# Altium project EPS-LKAS Manipulator.PrjPcb
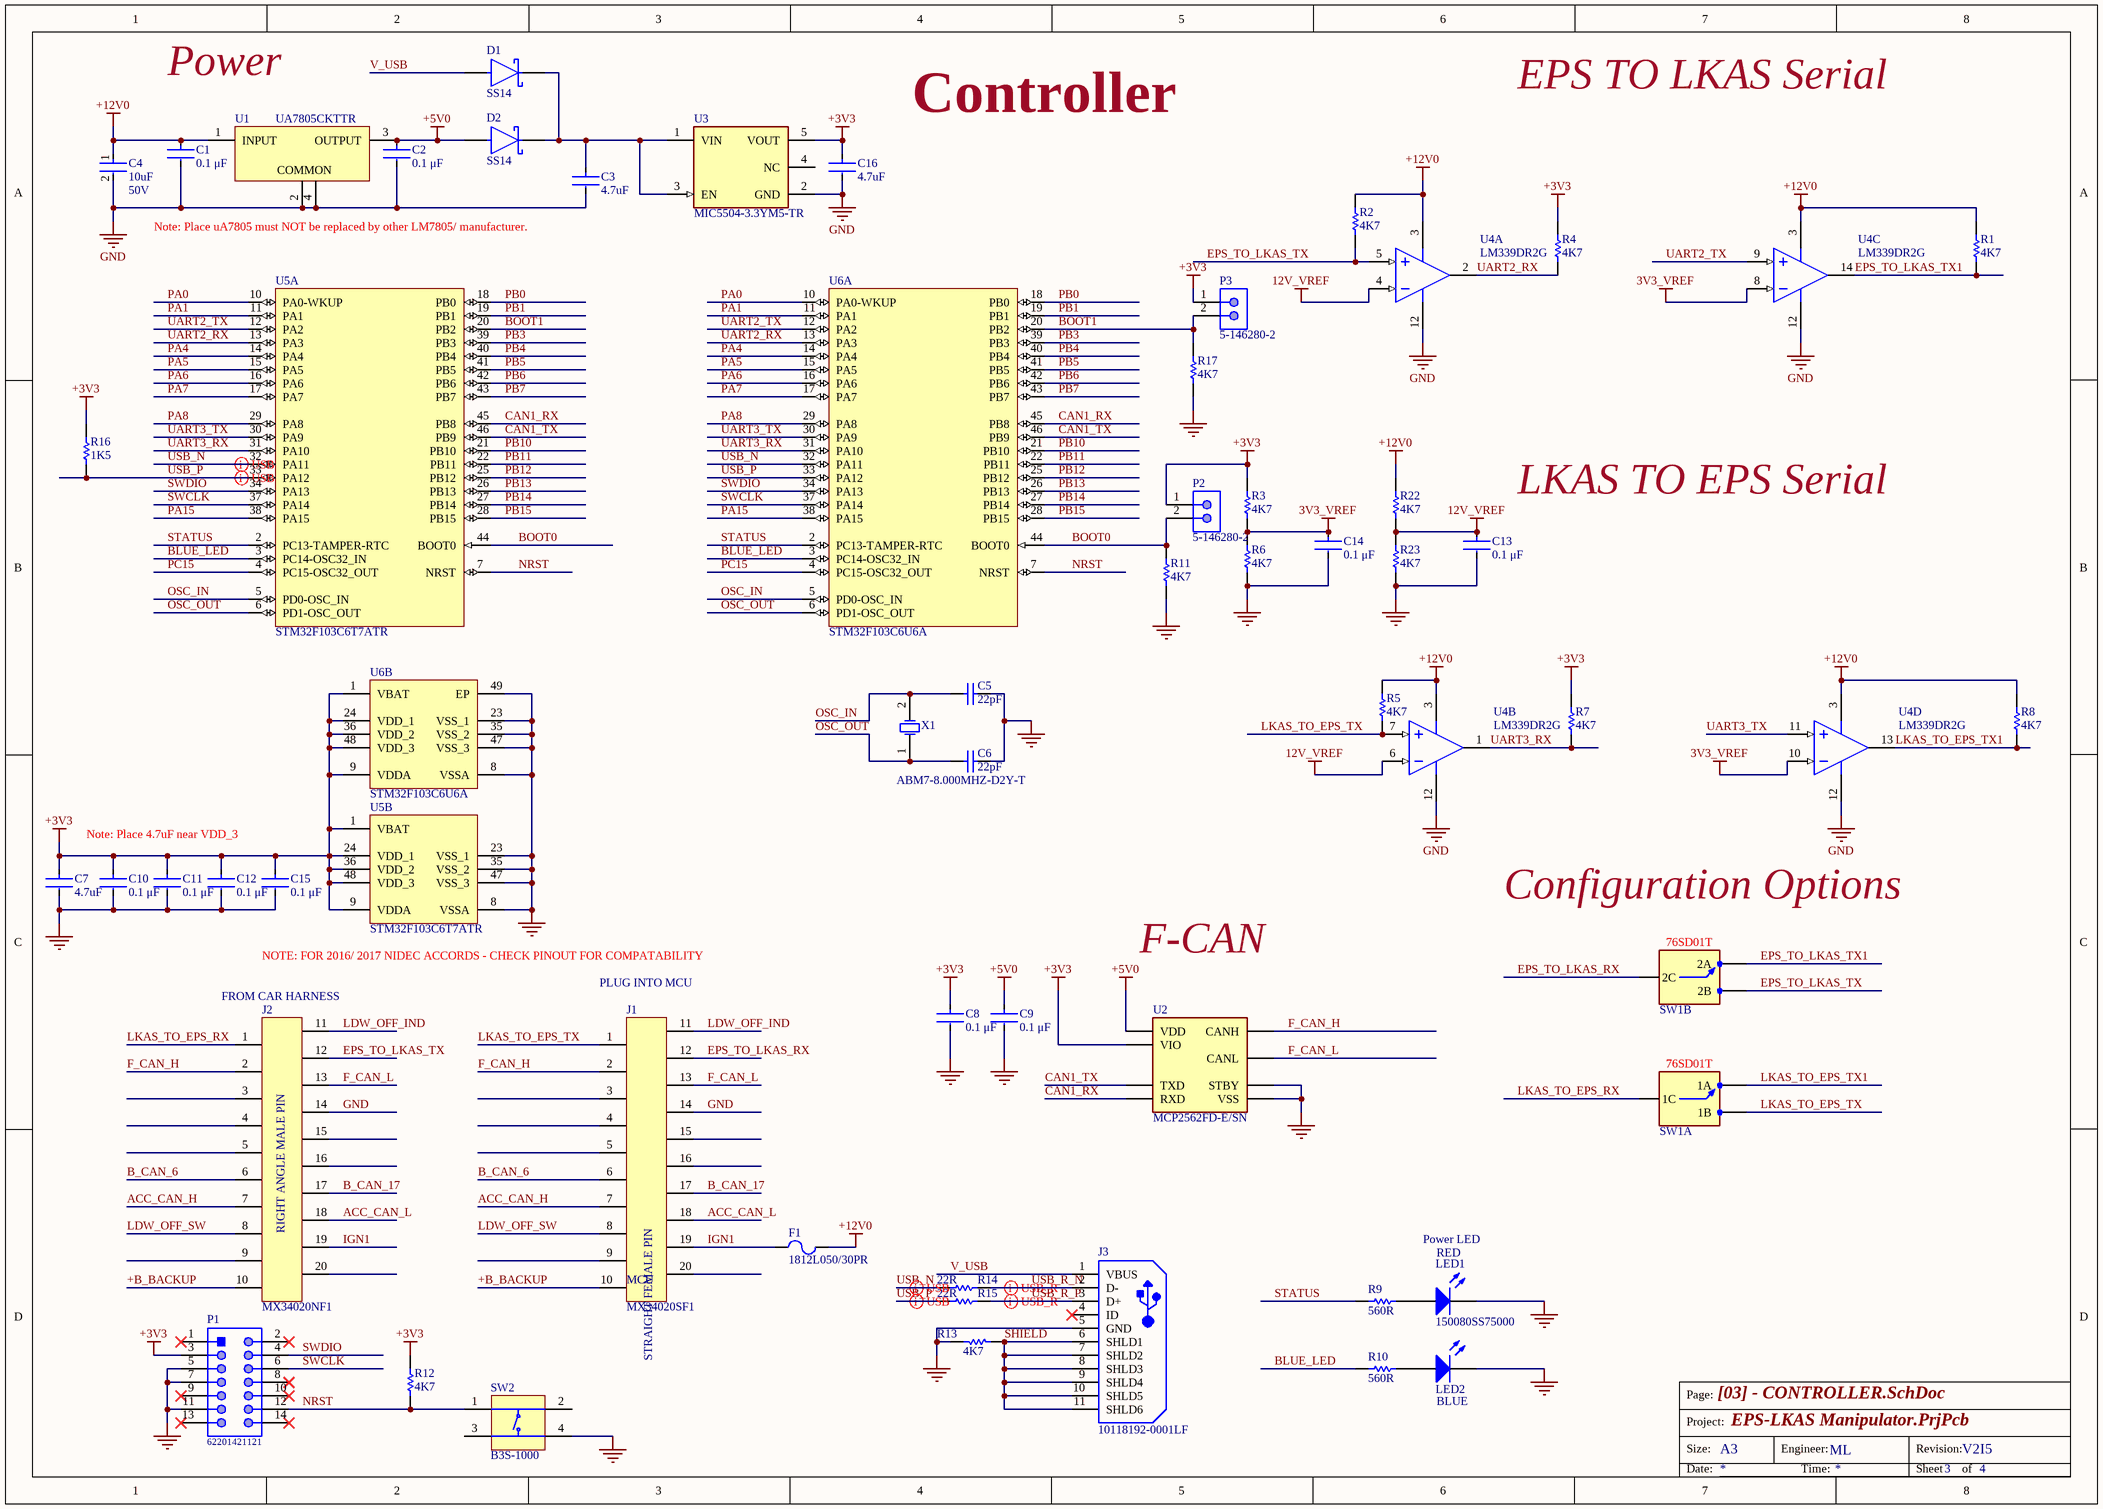
[diagram p0: [03] - CONTROLLER.SchDoc]
VersionRevision: V2I5; Project: EPS/LKAS Manipulator; Company: DEVINSTRUMENTS
2 sheets, 55 parts. Net scope: global (net labels, ports and power ports of the same name join across sheets).
Board files: LKAS-EPS_PCB_V2I5.PcbDoc, DO NOT USE LKAS-EPS_PCB_V2I1.PcbDoc
Sheets:
  [03] - CONTROLLER.SchDoc
  [04] - DOC REVISION HISTORY.SchDoc

## Sheet [03] - CONTROLLER.SchDoc
size A3; DocumentNumber: 3; SheetNumber: 3; SheetTotal: 4; Organization: Altium Limited; Address1: L3, 12a Rodborough Rd; Address2: Frenchs Forest; Address3: NSW; Address4: Australia 2086

### Parts
C1  Capacitance: 0.1 μF  [FP-C0603C-CF-MFG]  (hidden comment: C0603C104M3RACTU)
C2  Capacitance: 0.1 μF  [FP-C0603C-CF-MFG]  (hidden comment: C0603C104M3RACTU)
C3  Capacitance: 4.7uF  [FP-CL10-IPC_C]  (hidden comment: CL10B475KQ8NQNC)
C4  value 10uF  Voltage: 50V  [FP-CL31-IPC_C]  (hidden comment: CL31A106KBHNNNE)
C5  Capacitance: 22pF  [CAPC1608X90X35ML10T15]  (hidden comment: GRM1885C1H220JA01D)
C6  Capacitance: 22pF  [CAPC1608X90X35ML10T15]  (hidden comment: GRM1885C1H220JA01D)
C7  Capacitance: 4.7uF  [FP-CL10-IPC_C]  (hidden comment: CL10B475KQ8NQNC)
C8  Capacitance: 0.1 μF  [FP-C0603C-CF-MFG]  (hidden comment: C0603C104M3RACTU)
C9  Capacitance: 0.1 μF  [FP-C0603C-CF-MFG]  (hidden comment: C0603C104M3RACTU)
C10  Capacitance: 0.1 μF  [FP-C0603C-CF-MFG]  (hidden comment: C0603C104M3RACTU)
C11  Capacitance: 0.1 μF  [FP-C0603C-CF-MFG]  (hidden comment: C0603C104M3RACTU)
C12  Capacitance: 0.1 μF  [FP-C0603C-CF-MFG]  (hidden comment: C0603C104M3RACTU)
C13  Capacitance: 0.1 μF  [FP-C0603C-CF-MFG]  (hidden comment: C0603C104M3RACTU)
C14  Capacitance: 0.1 μF  [FP-C0603C-CF-MFG]  (hidden comment: C0603C104M3RACTU)
C15  Capacitance: 0.1 μF  [FP-C0603C-CF-MFG]  (hidden comment: C0603C104M3RACTU)
C16  Capacitance: 4.7uF  [FP-CL10-IPC_C]  (hidden comment: CL10B475KQ8NQNC)
D1  SS14  [FP-403AE-MFG]
D2  SS14  [FP-403AE-MFG]
F1  1812L050/30PR  [LFUS-1812L05030PR_V]
J1  MX34020SF1  [MX34020SF1]
J2  MX34020NF1  [MX34020NF1]
J3  10118192-0001LF  [FCI-10118192-0001LF-5_V]
LED1  150080SS75000  [0805_A]
LED2  150080BS75000  [0805_A]  (value not drawn)
P1  62201421121  [62201421121]  (no BOM)
P2  5-146280-2  [TECO-5-146280-2_V]
P3  5-146280-2  [TECO-5-146280-2_V]
R1  4K7  [R0603]
R2  4K7  [R0603]
R3  4K7  [R0603]
R4  4K7  [R0603]
R5  4K7  [R0603]
R6  4K7  [R0603]
R7  4K7  [R0603]
R8  4K7  [R0603]
R9  Resistance: 560R  [RESC1608X55X25ML10T15]  (hidden comment: RC0603FR-07560RL)
R10  Resistance: 560R  [RESC1608X55X25ML10T15]  (hidden comment: RC0603FR-07560RL)
R11  4K7  [R0603]
R12  4K7  [R0603]
R13  4K7  [R0603]
R14  value 22R  [RESC1609X50X30ML10T20]  (hidden comment: CRCW060322R0JNTA)
R15  value 22R  [RESC1609X50X30ML10T20]  (hidden comment: CRCW060322R0JNTA)
R16  Res: 1K5  [RESC1609X50X30ML10T20]  (hidden comment: CRCW06031K50FKTA)
R17  4K7  [R0603]
R22  4K7  [R0603]
R23  4K7  [R0603]
SW1  76STC02T  [76STC02T]  (value not drawn)  (parts A,B of 2)
SW2  B3S-1000  [OMRON-B3S-1000-4_V]
U1  UA7805CKTTR  [KTT0003A_V]
U2  MCP2562FD-E/SN  [MCP2561]
U3  MIC5504-3.3YM5-TR  [FP-SOT23-5LD-PL-1-MFG]
U4  LM339DR2G  [ONSC-SOIC-14-751A-03_V]  (parts A,B,C,D of 4)
U5  STM32F103C6T7ATR  [STM-LQFP48_L]  (parts A,B of 2)
U6  STM32F103C6U6A  [STM-UFQFPN48_M]  (parts A,B of 2)
X1  ABM7-8.000MHZ-D2Y-T  [ABRA-ABM7-2_V]

### Nets
3V3_VREF: C14.1 R3.1 R6.2 U4.8(IN3-) U4.10(IN4-)
12V_VREF: C13.1 R22.1 R23.2 U4.4(IN1-) U4.6(IN2-)
+3V3: C7.1 C8.1 C10.1 C11.1 C12.1 C15.1 C16.1 P1.3 P2.1 P3.1 R3.2 R4.2 R7.2 R12.2 R16.2 U2.5(VIO) U3.5(VOUT) U5.1(VBAT) U5.9(VDDA) U5.24(VDD_1) U5.36(VDD_2) U5.48(VDD_3) U6.1(VBAT) U6.9(VDDA) U6.24(VDD_1) U6.36(VDD_2) U6.48(VDD_3)
+5V0: C2.1 C9.1 D2.1(A) U1.3(OUTPUT) U2.3(VDD)
+12V0: C1.1 C4.1 F1.2 R1.2 R2.2 R5.2 R8.2 R22.2 U1.1(INPUT) U4.3(VCC)
GND: C1.2 C2.2 C3.2 C4.2 C5.2 C6.2 C7.2 C8.2 C9.2 C10.2 C11.2 C12.2 C13.2 C14.2 C15.2 C16.2 J1.14 J2.14 J3.5(GND) LED1.1(K) LED2.1(K) P1.5 P1.7 P1.11 R6.1 R11.1 R13.2 R17.1 R23.1 SW2.4 U1.2(COMMON) U1.4(COMMON) U2.2(VSS) U2.8(STBY) U3.2(GND) U4.12(GND) U5.8(VSSA) U5.23(VSS_1) U5.35(VSS_2) U5.47(VSS_3) U6.8(VSSA) U6.23(VSS_1) U6.35(VSS_2) U6.47(VSS_3) U6.49(EP)
+B_BACKUP: J1.10 J2.10
ACC_CAN_H: J1.7 J2.7
ACC_CAN_L: J1.18 J2.18
B_CAN_6: J1.6 J2.6
B_CAN_17: J1.17 J2.17
BLUE_LED: R10.1 U5.3(PC14-OSC32_IN) U6.3(PC14-OSC32_IN)
BOOT0: P2.2 R11.2 U5.44(BOOT0) U6.44(BOOT0)
BOOT1: P3.2 R17.2 U5.20(PB2) U6.20(PB2)
CAN1_RX: U2.4(RXD) U5.45(PB8) U6.45(PB8)
CAN1_TX: U2.1(TXD) U5.46(PB9) U6.46(PB9)
EPS_TO_LKAS_RX: J1.12 SW1.C2(2C)
EPS_TO_LKAS_TX: J2.12 R2.1 SW1.2B U4.5(IN1+)
EPS_TO_LKAS_TX1: R1.1 SW1.2A U4.14(OUT3)
F_CAN_H: J1.2 J2.2 U2.7(CANH)
F_CAN_L: J1.13 J2.13 U2.6(CANL)
IGN1: F1.1 J1.19 J2.19
LDW_OFF_IND: J1.11 J2.11
LDW_OFF_SW: J1.8 J2.8
LKAS_TO_EPS_RX: J2.1 SW1.C1(1C)
LKAS_TO_EPS_TX: J1.1 R5.1 SW1.1B U4.7(IN2+)
LKAS_TO_EPS_TX1: R8.1 SW1.1A U4.13(OUT4)
NRST: P1.12 R12.1 SW2.1 U5.7(NRST) U6.7(NRST)
OSC_IN: C5.1 U5.5(PD0-OSC_IN) U6.5(PD0-OSC_IN) X1.2(X2)
OSC_OUT: C6.1 U5.6(PD1-OSC_OUT) U6.6(PD1-OSC_OUT) X1.1(X1)
PA0: U5.10(PA0-WKUP) U6.10(PA0-WKUP)
PA1: U5.11(PA1) U6.11(PA1)
PA4: U5.14(PA4) U6.14(PA4)
PA5: U5.15(PA5) U6.15(PA5)
PA6: U5.16(PA6) U6.16(PA6)
PA7: U5.17(PA7) U6.17(PA7)
PA8: U5.29(PA8) U6.29(PA8)
PA15: U5.38(PA15) U6.38(PA15)
PB0: U5.18(PB0) U6.18(PB0)
PB1: U5.19(PB1) U6.19(PB1)
PB3: U5.39(PB3) U6.39(PB3)
PB4: U5.40(PB4) U6.40(PB4)
PB5: U5.41(PB5) U6.41(PB5)
PB6: U5.42(PB6) U6.42(PB6)
PB7: U5.43(PB7) U6.43(PB7)
PB10: U5.21(PB10) U6.21(PB10)
PB11: U5.22(PB11) U6.22(PB11)
PB12: U5.25(PB12) U6.25(PB12)
PB13: U5.26(PB13) U6.26(PB13)
PB14: U5.27(PB14) U6.27(PB14)
PB15: U5.28(PB15) U6.28(PB15)
PC15: U5.4(PC15-OSC32_OUT) U6.4(PC15-OSC32_OUT)
SHIELD: J3.6(SHLD1) J3.7(SHLD2) J3.8(SHLD3) J3.9(SHLD4) J3.10(SHLD5) J3.11(SHLD6) R13.1
STATUS: R9.1 U5.2(PC13-TAMPER-RTC) U6.2(PC13-TAMPER-RTC)
SWCLK: P1.6 U5.37(PA14) U6.37(PA14)
SWDIO: P1.4 U5.34(PA13) U6.34(PA13)
UART2_RX: R4.1 U4.2(OUT1) U5.13(PA3) U6.13(PA3)
UART2_TX: U4.9(IN3+) U5.12(PA2) U6.12(PA2)
UART3_RX: R7.1 U4.1(OUT2) U5.31(PA10) U6.31(PA10)
UART3_TX: U4.11(IN4+) U5.30(PA9) U6.30(PA9)
USB_N: R14.1 U5.32(PA11) U6.32(PA11)
USB_P: R15.1 R16.1 U5.33(PA12) U6.33(PA12)
USB_R_N: J3.2(D-) R14.2
USB_R_P: J3.3(D+) R15.2
V_USB: D1.1(A) J3.1(VBUS)
NetC3_1: C3.1 D1.2(C) D2.2(C) U3.1(VIN) U3.3(EN)
NetLED1_2: LED1.2(A) R9.2
NetLED2_2: LED2.2(A) R10.2

Not connected (* = marked no-connect by the designer): J1 3 4 5 9 15 16 20; J2 3 4 5 9 15 16 20; J3 4(ID)*; P1 1* 2* 8* 9* 10* 13* 14*; SW2 2 3; U3 4(NC)

### Layout directives
differential pair: USB_N, USB_P, USB_R_N, USB_R_P
differential pair; differential pair class *; rule Matched Net Lengths [Tolerance = 150mil]: USB_N, USB_P

### Notes on the sheet
- Power
- EPS TO LKAS Serial
- Controller
- Note: Place uA7805 must NOT be replaced by other LM7805/ manufacturer.
- LKAS TO EPS Serial
- Note: Place 4.7uF near VDD_3
- Configuration Options
- NOTE: FOR 2016/ 2017 NIDEC ACCORDS - CHECK PINOUT FOR COMPATABILITY
- (near J1) PLUG INTO MCU
- F-CAN
- (near SW1) 76SD01T
- (near J2) FROM CAR HARNESS
- Power LED
- RED
- (near J1) MCU
- (near LED2) BLUE
- Page:
- Size:
- Project:
- A3
- Engineer:
- ML
- Revision:
- Date:
- Time:
- Sheet
- of
- (in symbol MX34020NF1) RIGHT ANGLE MALE PIN
- (in symbol MX34020SF1) STRAIGHT FEMALE PIN

### Library data of the parts
C1 C2 C8-C15 = CMP-2006-03065-2: CAP CER 0.1UF 25V X7R 0603; Manufacturer: KEMET; Material: Ceramic; Automotive Grade: Grade 1; Value: 0.10 μF; Tolerance: 0.2; Temperature Coefficient: 30ppm/°C; Manufacturer Part Number: C0603C104M3RACTU; Automotive: Yes; Temperature Range High: +125°C; Device Class L3: Ceramic Capacitors; Octopart: https://octopart.com/c0603c104m3ractu-kemet-95914; Height: 0.87mm; Voltage Rating: 25 V; Temperature Range Low: -55°C; Lead Free: Yes; Mouser Description: Multilayer Ceramic Capacitors MLCC - SMD/SMT 25volts 0.1uF X7R 20%; RoHS: TRUE; Package: C0603C-CF; ComponentLink2Description: Datasheet; Category: Cap; Temperature: -55°C to +125°C; Device Class L1: Passive Components; ComponentLink2URL: https://api.kemet.com/component-edge/download/datasheet/C0603C100J5GACAUTO.pdf; Temperature Characteristic: X7R; Device Class L2: Capacitors; Digikey Description: CAP CER 0.1UF 25V X7R 0603
C3 C7 C16 = CMP-2000-06096-2: CAP CER 4.7UF 6.3V X7R 0603; Manufacturer: Samsung; Tolerance: 10%; Material: Ceramic; Temperature Coefficient: 15%; Device Class L3: Ceramic Capacitors; Temperature Characteristic: X7R; Automotive: No; Package: CL10; Device Class L2: Capacitors; Octopart: https://octopart.com/cl10b475kq8nqnc-samsung-24957976; ComponentLink2Description: Datasheet; Temperature Range High: +125°C; Lead Free: Yes; Height: 0.95mm; Temperature: -55°C to +125°C; Ipc Land Pattern Name: CAPC16080X80; Temperature Range Low: -55°C; Digikey Description: CAP CER 4.7UF 6.3V X7R 0603; Mouser Description: C Series 0402 4.7 uF 6.3 V ±20 % Tolerance X5R SMT Multilayer Ceramic Capacitor; Category: Cap; ComponentLink2URL: http://www.samsungsem.com/kr/support/product-search/mlcc/__icsFiles/afieldfile/2018/07/24/CL10B475KQ8NQNC.pdf; Value: 4.7uF; Voltage Rating: 6.3V; Manufacturer Part Number: CL10B475KQ8NQNC; Device Class L1: Passive Components; RoHS: TRUE
C4 = CMP-13271-000016-1: CAP CER 10UF 50V X5R 1206; Manufacturer: Samsung; Tolerance: 10%; Material: Ceramic; Temperature Coefficient: 15%; RoHS: TRUE; Ipc Land Pattern Name: CAPC320160X160; Temperature Range Low: -55°C; Device Class L3: Ceramic Capacitors; Category: Cap; Temperature Characteristic: X5R; Lead Free: Yes; Device Class L2: Capacitors; Octopart: https://octopart.com/cl31a106kbhnnne-samsung-19832778; ComponentLink2Description: Datasheet; Digikey Description: CAP CER 10UF 50V X5R 1206; ComponentLink2URL: http://www.samsungsem.com/kr/support/product-search/mlcc/__icsFiles/afieldfile/2018/06/21/CL31A106KBHNNNE.pdf; Capacitance: 10uF; Manufacturer Part Number: CL31A106KBHNNNE; Temperature Range High: +85°C; Device Class L1: Passive Components; Height: 1.8mm; Automotive: No; Voltage Rating: 50V; Package: CL31; Temperature: -55°C to +85°C
C5 C6 = CMP-2000-04945-1: Chip Capacitor, 22 pF, +/- 5%, 50 V, -55 to 125 degC, 0603 (1608 Metric), RoHS, Tape and Reel; Manufacturer: Murata; Rated Voltage: 50V; Dielectric: C0G; Manufacturer URL: http://www.murata.com/; Datasheet Version: Jul-06; Package Reference: 603; Tolerance (%): ±5%; Case Size/Dimension: 0603; Package Description: 2-Pin Surface Mount Device, Body 1.6 x 0.8 mm; Datasheet URL: https://datasheet.ciiva.com/11786/0900766b807a1cab-11786398.pdf
D1 D2 = CMP-2000-04943-2: DIODE SCHOTTKY 40V 1A SMA; Manufacturer: ON Semiconductor; Peak Reverse Current: 0.2mA; Max Junction Temp: +125°C; Standoff Height: 0.05mm; Max Surge Forward Current: 40A; Mouser Description: Schottky Diodes & Rectifiers SMA 40V 1.0A; RoHS: TRUE; Lead Free: Yes; Manufacturer Part Number: SS14; Device Class L3: Schottky Diodes; Category: Diode; Automotive: No; Digikey Description: DIODE SCHOTTKY 40V 1A SMA; ComponentLink2Description: Datasheet; Device Class L2: Diodes; Height: 2.5mm; Temperature Range High: +125°C; ComponentLink2URL: https://www.onsemi.com/pub/Collateral/SS19-D.PDF; Device Class L1: Discrete Semiconductors; Package: 403AE; Octopart: https://octopart.com/ss14-on+semiconductor-29205033; Max Repetitive Reverse Voltage: 40V; Temperature Range Low: -65°C; Forward Current: 1A; Temperature: -65°C to +125°C
F1 = CMP-2000-05508-1: PTC Resettable Fuse, 0.8 W, 30 V, -40 to 85 degC, 2-Pin SMD, RoHS, Tape and Reel; Manufacturer: Littelfuse-Inc.; Voltage - Max: 30V; Current - Hold (Ih) (Max): 500mA; Time to Trip: 0.15s; Current - Max: 100A; R Min/Max: 0.150~1.000Ohm; Current - Trip (It): 1A; Package Reference: 1812; Family: PTCResettableFuses; Packaging: Tape&Reel(TR); Package / Case: 1812(4532Metric),Concave; Series: POLY-FUSE®,1812L; Mounting Technology: SurfaceMount; Datasheet Version: 02/2016; Datasheet URL: http://www.littelfuse.com/~/media/electronics/datasheets/resettable_ptcs/littelfuse_ptc_1812l_datasheet.pdf.pdf; Manufacturer URL: http://www.littelfuse.com/; Category: CircuitProtection; Package Description: 2-Pin Surface Mount Device, Body 4.55 x 3.24 mm
J1 = MX34020SF1: Automotive Connectors Sckt HOUSING 20P; Manufacturer: JAE Electronics; Number of Positions: 20; Connector Type: Receptacle,Socket,Rectangular; Gender: Female; Current Rating: 3A; Pitch: 0.087inch; Row Spacing: 0.118inch; Supplier 1: Digi-Key; Manufacturer Part Number: MX34020SF1; RoHS: Yes; Category: Connectors; Stock 1: 3393; Pricing 1: 1=0.73000, 10=0.63800, 25=0.60000, 50=0.57500, 100=0.55000, 250=0.50000, 576=0.45000, 1152=0.40000, 2880=0.36250 (USD); Mount: Free Hanging,Cable; Color: Grey; Contact Plating: Tin; Contact Material: Copper Alloy,Copper; Housing Material: PPE; Min Operating Temperature: -40°C; Max Operating Temperature: 85°C; Termination: Crimp; Packaging: Tray; Package Quantity: 192; Number of Contacts: 20; Number of Rows: 2; Height: 14mm; Depth: 21.3mm; Width: 25.1mm; ComponentLink1URL: https://datasheet.ciiva.com/11742/0900766b80fc15d5-11742077.pdf?src-supplier=RSComponents; ComponentLink1Description: https://datasheet.ciiva.com/11742/0900766b80fc15d5-11742077.pdf?src-supplier=RSComponents; ComponentLink2URL: https://datasheet.ciiva.com/4553/sj038752-64597-4553699.pdf?src-supplier=Mouser; ComponentLink2Description: https://datasheet.ciiva.com/4553/sj038752-64597-4553699.pdf?src-supplier=Mouser; ComponentLink3URL: https://datasheet.ciiva.com/6739/614004-6739335.pdf?src-supplier=Newark; ComponentLink3Description: https://datasheet.ciiva.com/6739/614004-6739335.pdf?src-supplier=Newark; ComponentLink4URL: https://datasheet.ciiva.com/762/transportation-pg-v2-2-762885.pdf?src-supplier=Digi-Key; ComponentLink4Description: https://datasheet.ciiva.com/762/transportation-pg-v2-2-762885.pdf?src-supplier=Digi-Key; ComponentLink5URL: https://datasheet.ciiva.com/5821/1009688-5821398.pdf?src-supplier=Farnell; ComponentLink5Description: https://datasheet.ciiva.com/5821/1009688-5821398.pdf?src-supplier=Farnell; ComponentLink6URL: https://datasheet.ciiva.com/7648/1009712-7648886.pdf?src-supplier=Element14; ComponentLink6Description: https://datasheet.ciiva.com/7648/1009712-7648886.pdf?src-supplier=Element14; Supplier Part Number 1: 670-2925-ND
J2 = MX34020NF1: JAE MX34 Series, 2.2mm Pitch 20 Way 2 Row Right Angle PCB Header, Solder Termination, 3A; Manufacturer: JAE Electronics; Connector Type: Male Pin,Rectangular; Gender: Male; Number of Positions: 20; Pitch: 0.087inch; Row Spacing: 0.118inch; Supplier 1: Digi-Key; Manufacturer Part Number: MX34020NF1; RoHS: Yes; Category: Connectors; Stock 1: 10297; Pricing 1: 1=1.57000, 10=1.42100, 100=1.21800, 500=1.01500, 1000=0.87000, 5000=0.77140, 10000=0.75400 (USD); Mount: Through Hole; Contact Material: Brass; Contact Plating: Tin; Color: Grey; Number of Rows: 2; Package Quantity: 288; Packaging: Rail/Tube; Current Rating: 3A; Termination: Solder; Orientation: Right Angle; Number of Contacts: 20; Contact Mating Length: 0.303inch; REACH SVHC: No SVHC; ComponentLink1URL: https://datasheet.ciiva.com/7621/1009688-7621584.pdf?src-supplier=Element14; ComponentLink1Description: https://datasheet.ciiva.com/7621/1009688-7621584.pdf?src-supplier=Element14; ComponentLink2URL: https://datasheet.ciiva.com/4554/sj038751-3818-4554108.pdf?src-supplier=Mouser; ComponentLink2Description: https://datasheet.ciiva.com/4554/sj038751-3818-4554108.pdf?src-supplier=Mouser; ComponentLink3URL: https://datasheet.ciiva.com/11754/0900766b80ddc6f0-11754159.pdf?src-supplier=RSComponents; ComponentLink3Description: https://datasheet.ciiva.com/11754/0900766b80ddc6f0-11754159.pdf?src-supplier=RSComponents; ComponentLink4URL: https://datasheet.ciiva.com/732/transportation-pg-v2-2-732931.pdf?src-supplier=Digi-Key; ComponentLink4Description: https://datasheet.ciiva.com/732/transportation-pg-v2-2-732931.pdf?src-supplier=Digi-Key; Supplier Part Number 1: 670-2924-ND
J3 = CMP-2000-05118-1: Micro USB B Type Receptacle, -55 to 85 degC, 5-Pin SMD, RoHS, Tape and Reel; Manufacturer: FCI; Current Rating: 1.8A; Number of Contacts: 5Contact; Mounting Angle: Right; Insulation Resistance: 1000MOhms; Connector Type: MicroUSBTypeBreceptacle; Gender: Female; Packaging: Reel; Termination Style: SMD/SMT; Product Category: USBConnectors; RoHS: Details; Flammability Rating: UL94V-0; Standard: USB2.0; Brand: FCI; Manufacturer URL: http://www.fci.com/; Product: MicroUSBTypeBConnectors; Operating Temperature Range: -55Cto+85C; Datasheet Version: Rev. B, 05/2015; Contact Material: CopperAlloy; Contact Plating: Gold; Datasheet URL: http://www.mouser.com/ds/2/154/10118192-793027.pdf; Color: Black; Factory Pack Quantity: 1400
LED1 = CMP-1426-00010-1: SMD mono-color Chip LED, WL-SMCW, Super Red; Manufacturer: Wuerth Elektronik; PackageReference: 0805_A; ComponentLink2URL: http://katalog.we-online.com/led/datasheet/150080SS75000.pdf; ComponentLink1URL: http://www.we-online.com; Color: Super Red; ComponentLink2Description: Datasheet; ComponentLink1Description: Manufacturer URL; PartNumber: 150080SS75000
LED2 = CMP-1426-00008-1: SMD mono-color Chip LED, WL-SMCW, Blue; Manufacturer: Wuerth Elektronik; Color: Blue; ComponentLink2URL: http://katalog.we-online.com/led/datasheet/150080BS75000.pdf; ComponentLink1URL: http://www.we-online.com; ComponentLink2Description: Datasheet; PackageReference: 0805_A; ComponentLink1Description: Manufacturer URL; PartNumber: 150080BS75000
P1 = CMP-1502-00949-1: THT Vertical Pin Header WR-PHD, Pitch 1.27 mm, Dual Row, 14 pins; Manufacturer: Wurth Elektronik; Pin Number: 14; Withstanding Voltage: 500VAC; Rated Current: 1A; Working Voltage: 100VAC; Pitch: 1.27mm; Gender: Male; Contact Resistance: 20mOhm; Packaging: Box; Operating Temperature: -40to105degC; Part Number: 62201421121; Publisher: WurthElektronik; Datasheet URL: https://katalog.we-online.de/em/datasheet/62201421121.pdf; Manufacturer URL: http://www.we-online.de; Package Reference: 62201421121; Mounting Technology: THT; Orientation: Vertical; Row Number: Dual
P2 P3 = CMP-2000-07492-1: Male Header, Pitch 2.54 mm, 1 x 2 Position, Height 8.21 mm, Tail Length 3.05 mm, -65 to 105 degC, RoHS, Bulk; Manufacturer: TE Connectivity; Mating Connector Lock: No(Without); Number of Positions: 2; Pitch: 2.54mm; PCB Mounting Orientation: Vertical; Keyed: No; Case\/Package: 100; Mating Post Length: 0.23inch; High Temperature Housing: Yes; Max Current Rating: 5A; PCB Thickness: 0.063inch; PCB Mount Retention: Without; Approvals: CSA; Current Rating: 3A; Radiation Hardening: No; Length: 4.67mm; Contact Mating Length: 0.23inch; Connector Type: Header; Number of Rows: 1; Termination Post Length: 0.12inch; Board Standoff: No(Without); Max Operating Temperature: 105degC; Contact Shape: Square; Selectively Loaded: No(Without); Gasket: No(Without); Number of Contacts: 2; Contact Gender: Male; Mating Alignment: No(Without); Manufacturer URL: http://www.te.com/; Datasheet URL: http://www.te.com/commerce/DocumentDelivery/DDEController?Action=showdoc&DocId=Customer+Drawing%7F146280%7FH1%7Fpdf%7FEnglish%7FENG_CD_146280_H1.pdf%7F5-146280-2; Mount: ThroughHole; Orientation: Straight; Packaging: Carton; Package Reference: 5-146280-2; Package Quantity: 500; Stabilizers: No(Without); Row Spacing: 2.54mm; Contact Material: CopperAlloy; Panel Mount Retention: No(Without); Datasheet Version: Rev. H1, 08/2016; Housing Colour: Black; Colour: Black; Package Description: Male Header, Pitch 2.54 mm, 1 x 2 Position, Height 8.21 mm, Tail Length 3.05 mm; Contact Plating: Matte; Housing Material: Polymer; Contact Protection: No(Without); Min Operating Temperature: -65degC; Mounting Technology: ThroughHole; Flammability Rating: UL94V-0; RoHSCompliant: true; Termination: ThroughHole; Depth: 2.34mm; High Speed Serial Data Connector: No
R1-R8 R11-R13 R17 R22 R23 = RMCF0603FT4K70: Res Thick Film 0603 4.7K Ohm 1% 1/10W 100ppm/C Molded SMD SMD Paper T/R; Manufacturer: Stackpole Electronics; Max Power Dissipation: 100mW; Temperature Coefficient: 100ppm/°C; Resistance: 4.7kR; Supplier 1: Digi-Key; Manufacturer Part Number: RMCF0603FT4K70; RoHS: Yes; Category: Chip SMD Resistors; Stock 1: 1530231; Pricing 1: 1=0.10000, 10=0.01500, 100=0.00590, 1000=0.00265, 2500=0.00230 (USD); Mount: Surface Mount; Case/Package: 0603; Contact Plating: Tin,Matte; Case Code (Imperial): 0603; Case Code (Metric): 1608; Min Operating Temperature: -55°C; Max Operating Temperature: 155°C; Packaging: Tape and Reel; Tolerance: 1%; Power Rating: 100mW; Features: Automotive AEC-Q200; Resistor Type: Thick Film; Number of Terminations: 2; Length: 1.55mm; Width: 0.031inch; Height: 0.022inch; Depth: 0.8mm; Radiation Hardening: No; Military Standard: Not; Lead Free: Lead Free; ComponentLink1URL: https://datasheet.ciiva.com/26835/getdatasheetpartid-486078-26835642.pdf?src-supplier=Verical; ComponentLink1Description: https://datasheet.ciiva.com/26835/getdatasheetpartid-486078-26835642.pdf?src-supplier=Verical; Supplier Part Number 1: RMCF0603FT4K70CT-ND
R9 R10 = CMP-1659-00038-1: Chip Resistor, 560 Ohm, +/- 1%, 0.1 W, -55 to 155 degC, 0603 (1608 Metric), RoHS, Tape and Reel; Case\Package: 0603; Power Rating: 100 mW; Voltage Rating (DC): 50 V; Height: 0.45 mm; Case Code (Metric): 1608; Max Operating Temperature: 155 degC; PackageDescription: 2-Pin Surface Mount Device, Body 1.6 x 0.8 mm; PackageReference: 0603; ComponentLink2Description: Datasheet; ComponentLink1Description: Manufacturer URL; Case Code (Imperial): 0603; Packaging: Tape and Reel; DatasheetVersion: Rev. 4, 02/2016; ComponentLink2URL: http://www.yageo.com/documents/recent/PYu-RC_Group_51_RoHS_L_04.pdf; Length: 1.6 mm; Mount: Surface Mount; Min Operating Temperature: -55 degC; Pins: 2; RoHSCompliant: true; Voltage Rating: 50 V; REACH SVHC: No SVHC; Tolerance: 1%; ComponentLink1URL: http://www.yageo.com/; Width: 0.8 mm
R14 R15 = CMP-2000-03099-1: Manufacturer: Vishay Dale; Part Number: CRCW060322R0JNTA
R16 = CMP-2000-02996-1: Manufacturer: Vishay Dale; Part Number: CRCW06031K50FKTA
SW1 = 76STC02T: SWITCH TOGGLE DIP SPDT 150MA 30V / WIRED: / 1  2  3 / 4  5  6; Manufacturer: Grayhill; Body Material: Thermoplastic; Mechanical Life: 2000Cycles; Number of Positions: 4; Actuator Length: 5.08mm; Pitch: 0.1inch; Washable: No; Supplier 1: Digi-Key; Manufacturer Part Number: 76STC02T; RoHS: Yes; Category: DIP Switches; Stock 1: 149; Pricing 1: 1=4.74000, 10=4.54200, 25=4.14720, 100=3.59410, 250=3.25836, 500=3.02140, 1000=2.80417, 2500=2.54745, 5000=2.36972 (USD); Mount: Through Hole,PCB; Contact Material: Copper Alloy,Gold; Contact Plating: Gold; Min Operating Temperature: -40°C; Max Operating Temperature: 85°C; Throw Configuration: SPDT; Max Voltage Rating (DC): 30V; Termination: PC Pins; Packaging: Rail/Tube; Voltage Rating (DC): 30V; Max Current Rating: 150mA; Package Quantity: 13; Current Rating: 150mA; Electrical Life: 2000Cycles; Number of Circuits: 4; Contact Current Rating: 150mA; Voltage Rating: 30V; Actuator Type: Toggle; Orientation: Straight; Length: 0.78inch; Depth: 9.65mm; Radiation Hardening: No; REACH SVHC: No SVHC; Lead Free: Lead Free; ComponentLink1URL: https://datasheet.ciiva.com/16198/dip-series-76-and-78-spdt-16198550.pdf?src-supplier=Onlinecomponents.com; ComponentLink1Description: https://datasheet.ciiva.com/16198/dip-series-76-and-78-spdt-16198550.pdf?src-supplier=Onlinecomponents.com; ComponentLink2URL: https://datasheet.ciiva.com/2865/dip-series-76-and-78-spdt-2865964.pdf?src-supplier=Digi-Key; ComponentLink2Description: https://datasheet.ciiva.com/2865/dip-series-76-and-78-spdt-2865964.pdf?src-supplier=Digi-Key; Supplier Part Number 1: GH7721-ND
SW2 = CMP-1677-00001-4: Sealed Tactile Switch, SPST-NO, 3 to 24 V, -25 to 70 degC, 4-Pin SMD, RoHS, Bulk; Manufacturer: Omron; Voltage Rating: 24 V; Current Rating: 50 mA; Contact Plating: Silver; ComponentLink1Description: Manufacturer URL; Packaging: Bulk; Package Quantity: 1500; Min Operating Temperature: -25 degC; Max Operating Temperature: 70 degC; REACH SVHC: No SVHC; ComponentLink1URL: http://www.omron.com/; RoHSCompliant: true; PackageDescription: 4-Pin Surface Mount Device, Body 6.6 x 6 mm; ComponentLink2URL: http://www.omron.com/ecb/products/pdf/en-b3s.pdf; DatasheetVersion: 10/2014; Length: 6.6 mm; Height: 4.3 mm; ComponentLink2Description: Datasheet; Mount: Surface Mount; Mounting Technology: Surface Mount; PackageReference: B3S-1000
U1 = CMP-1685-00014-1: Fixed Positive Voltage Regulator, 7 to 25 V, 1.5 A, 0 to 125 degC, 3-Pin DDPAK (KTT), Green (RoHS / & no Sb/Br), Tape and Reel; Tolerance: 1%; Resistance: 220 Ohm; Case\Package: 0603; Voltage Rating: 50 V; Power Rating: 100 mW; Package Quantity: 5000; Min Operating Temperature: -55 degC; ComponentLink2Description: Datasheet; ComponentLink1Description: Manufacturer URL; RoHSCompliant: true; Mount: Surface Mount; PackageDescription: 3-Pin Surface Mount Device, Body 10.16 x 9.015 mm, Pitch 2.54 mm; Width: 0.8 mm; Max Operating Temperature: 155 degC; Pins: 2; ComponentLink1URL: http://www.ti.com/; Case Code (Metric): 1608; Packaging: Tape and Reel; Case Code (Imperial): 0603; Height: 0.45 mm; Code_JEDEC: TO-263; DatasheetVersion: SLVS056P, 01/2015; Length: 1.6 mm; REACH SVHC: No SVHC; ComponentLink2URL: http://www.ti.com/lit/ds/symlink/ua7805.pdf; PackageReference: KTT0003A; Voltage Rating (DC): 50 V
U2 = MCP2562FD-E/SN: 8 SOIC 3.90mm(.150in) TUBECAN Flexible Data Rate Transceiver; Manufacturer: Microchip; Supplier 1: Digi-Key; Manufacturer Part Number: MCP2562FD-E/SN; RoHS: Yes; Category: Interface ICs; Stock 1: 1433; Pricing 1: 1=0.96000, 25=0.80000, 100=0.73000 (USD); ComponentLink1URL: https://datasheet.ciiva.com/46406/1821190-46406053.pdf?src-supplier=Element14; ComponentLink1Description: https://datasheet.ciiva.com/46406/1821190-46406053.pdf?src-supplier=Element14; ComponentLink2URL: https://datasheet.ciiva.com/48512/mcp2562fd-e-mf-eng-tds-48512074.pdf?src-supplier=Distrelec; ComponentLink2Description: https://datasheet.ciiva.com/48512/mcp2562fd-e-mf-eng-tds-48512074.pdf?src-supplier=Distrelec; ComponentLink3URL: https://datasheet.ciiva.com/48473/20005284a-48473180.pdf?src-supplier=Avnet; ComponentLink3Description: https://datasheet.ciiva.com/48473/20005284a-48473180.pdf?src-supplier=Avnet; ComponentLink4URL: https://datasheet.ciiva.com/46406/1821190-46406061.pdf?src-supplier=Element14; ComponentLink4Description: https://datasheet.ciiva.com/46406/1821190-46406061.pdf?src-supplier=Element14; Supplier Part Number 1: MCP2562FD-E/SN-ND
U3 = CMP-2000-07604-2: IC REG LINEAR 3.3V 300MA SOT23-5; Quiescent Current: 38uA; Operating Supply Current: 42uA; Max Input Voltage: 5.5V; Min Input Voltage: 2.5V; Output Type: Fixed; Power Supply Rejection Ratio (PSRR): 60dB; Dropout Voltage: 380mV; Accuracy: 3%; Number of Outputs: 1; Nominal Output Voltage: 3.3V; Max Output Current: 300mA; Length: 2.9mm; Mount: Surface Mount; Width: 1.6mm; Packaging: Tape and Reel; Output Current: 300mA; Min Operating Temperature: -40°C; Max Operating Temperature: 125°C; Height: 1.1mm; Case/Package: SOT-23-5; REACH SVHC: No SVHC; Number of Pins: 5; Output Voltage: 3.3V
U4 = CMP-1305-00036-1: Single Supply Quad Comparators, 0 to 70 degC, 14-Pin SOIC, Pb-Free, Tape and Reel; Manufacturer: On Semiconductor; IO Typ (mA): 16; ComponentLink3URL: http://www.onsemi.com/pub_link/Collateral/751A-03.PDF; RoHS: TRUE; Packing: Tape and Reel; ComponentLink2Description: Datasheet; ComponentLink2URL: http://www.onsemi.com/pub_link/Collateral/LM339-D.PDF; ComponentLink1Description: Manufacturer URL; PackageVersion: Rev. K, 05/2011; DatasheetVersion: Rev. 20; PackageReference: SOIC-14-751A-03; ComponentLink1URL: http://www.onsemi.com/; PartNumber: LM339DR2G; PackageDescription: 14-Pin Small Outline Integrated Circuit, Body 8.65 x 3.9 mm, Pitch 1.27 mm; ComponentLink3Description: Package Specification; Mounting Technology: Surface Mount
U5 = CMP-0237-00257-3: ARM Cortex-M3 32-bit MCU, 32 KB Flash, 10 KB Internal RAM, 37 I/Os, 48-pin LQFP, -40 to 105 degC, Tape and Reel; Supply Voltage(Vcc) min (V): 2; A/D Converter: 2x12-bit (10 Channel); Internal RAM Size (kB): 10; Operating Frequency(F) (Processor speed) (MHz): 72; I/Os (High Current): 37; FLASH Size (Prog) (kB): 32; ComponentLink1URL: http://www.st.com/web/en/home.html; ComponentLink1Description: Manufacturer URL; PackageVersion: Rev. 6, 06/2013; ComponentLink3URL: http://www.st.com/st-web-ui/static/active/en/resource/technical/document/datasheet/DM00058181.pdf; ComponentLink2URL: http://www.st.com/st-web-ui/static/active/en/resource/technical/document/datasheet/CD00210843.pdf; ComponentLink2Description: Datasheet; Core: ARM Cortex-M3; Packing: Tape and Reel; PartNumber: STM32F103C6T7ATR; PackageReference: LQFP48; PackageDescription: 48-Pin Low Profile Quad Flat Package, 7 x 7 mm Body, 0.5 mm Pitch; Mounting Technology: Surface Mount; DatasheetVersion: Rev. 6; ComponentLink3Description: Package Specification
U6 = CMP-0237-00046-3: ARM Cortex-M3 32-bit MCU, 32 KB Flash, 10 KB Internal RAM, 37 I/Os, 48-pin UFQFPN, -40 to 85 degC, Tray; I/Os (High Current): 37; A/D Converter: 2x12-bit (10 Channel); Internal RAM Size (kB): 10; Operating Frequency(F) (Processor speed) (MHz): 72; Supply Voltage(Vcc) min (V): 2; FLASH Size (Prog) (kB): 32; ComponentLink3URL: http://www.st.com/st-web-ui/static/active/en/resource/technical/document/data_brief/DM00071938.pdf; Packing: Tray; ComponentLink2Description: Datasheet; ComponentLink2URL: http://www.st.com/st-web-ui/static/active/en/resource/technical/document/datasheet/CD00210843.pdf; ComponentLink3Description: Package Specification; PackageVersion: Rev. 1, 04/2013; PartNumber: STM32F103C6U6A; Mounting Technology: Surface Mount; ComponentLink1URL: http://www.st.com/web/en/home.html; DatasheetVersion: Rev. 6; Core: ARM Cortex-M3; PackageDescription: 48-Pin Ultra Thin Fine Pitch Quad Flat No-Lead, 7 x 7 x 0.6 mm Body, 0.5 mm Pitch, Exposed Pad; PackageReference: UFQFPN48; ComponentLink1Description: Manufacturer URL
X1 = CMP-2000-05034-1: Microprocessor Crystal, 8 MHz, 18 PF, -40 to 85 degC, 2-Pin SMD, RoHS, Tape and Reel; Manufacturer: Abracon; Online Catalog: ABM7Series; Load Capacitance: 18pF; Frequency Stability: ±30ppm; ESR (Equivalent Series Resistance): 100Ohm; Frequency: 8MHz; Operating Mode: Fundamental; 3D Model: ABM7.pdf / ABM7.stp; Catalog Drawings: ABM7SeriesTop / ABM7SeriesSide / ABM7SeriesBottom; Other Names: 535-9831-2 / ABM7-8.000MHZ-D-2-Y-T / ABM78000MHZD2YT; Frequency Tolerance: ±20ppm; Featured Product: ABM7andABM11Crystals; Category: CrystalsandOscillators; Operating Temperature: -40degC~85degC; Datasheet URL: https://datasheet.ciiva.com/1357/1718755-1357277.pdf; Packaging: Tape&Reel(TR); Package Reference: ABM7; Type: MHzCrystal; Datasheet Version: Dec-17; Package Description: 2-Pin Surface Mount Device, Body 6 x 3.5 mm; RoHS Information: RoHS2/REACHCompliance; Height: 0.055"(1.40mm); Family: Crystals; Standard Package: 1,000; Size / Dimension: 0.236"Lx0.138"W(6.00mmx3.50mm); Manufacturer URL: http://www.abracon.com/; Mounting Type: SurfaceMount; Series: ABM7; Package / Case: 2-SMD

## Sheet [04] - DOC REVISION HISTORY.SchDoc
size A3; DocumentNumber: 4; SheetNumber: 4; SheetTotal: 4; Organization: Altium Limited; Address1: L3, 12a Rodborough Rd; Address2: Frenchs Forest; Address3: NSW; Address4: Australia 2086
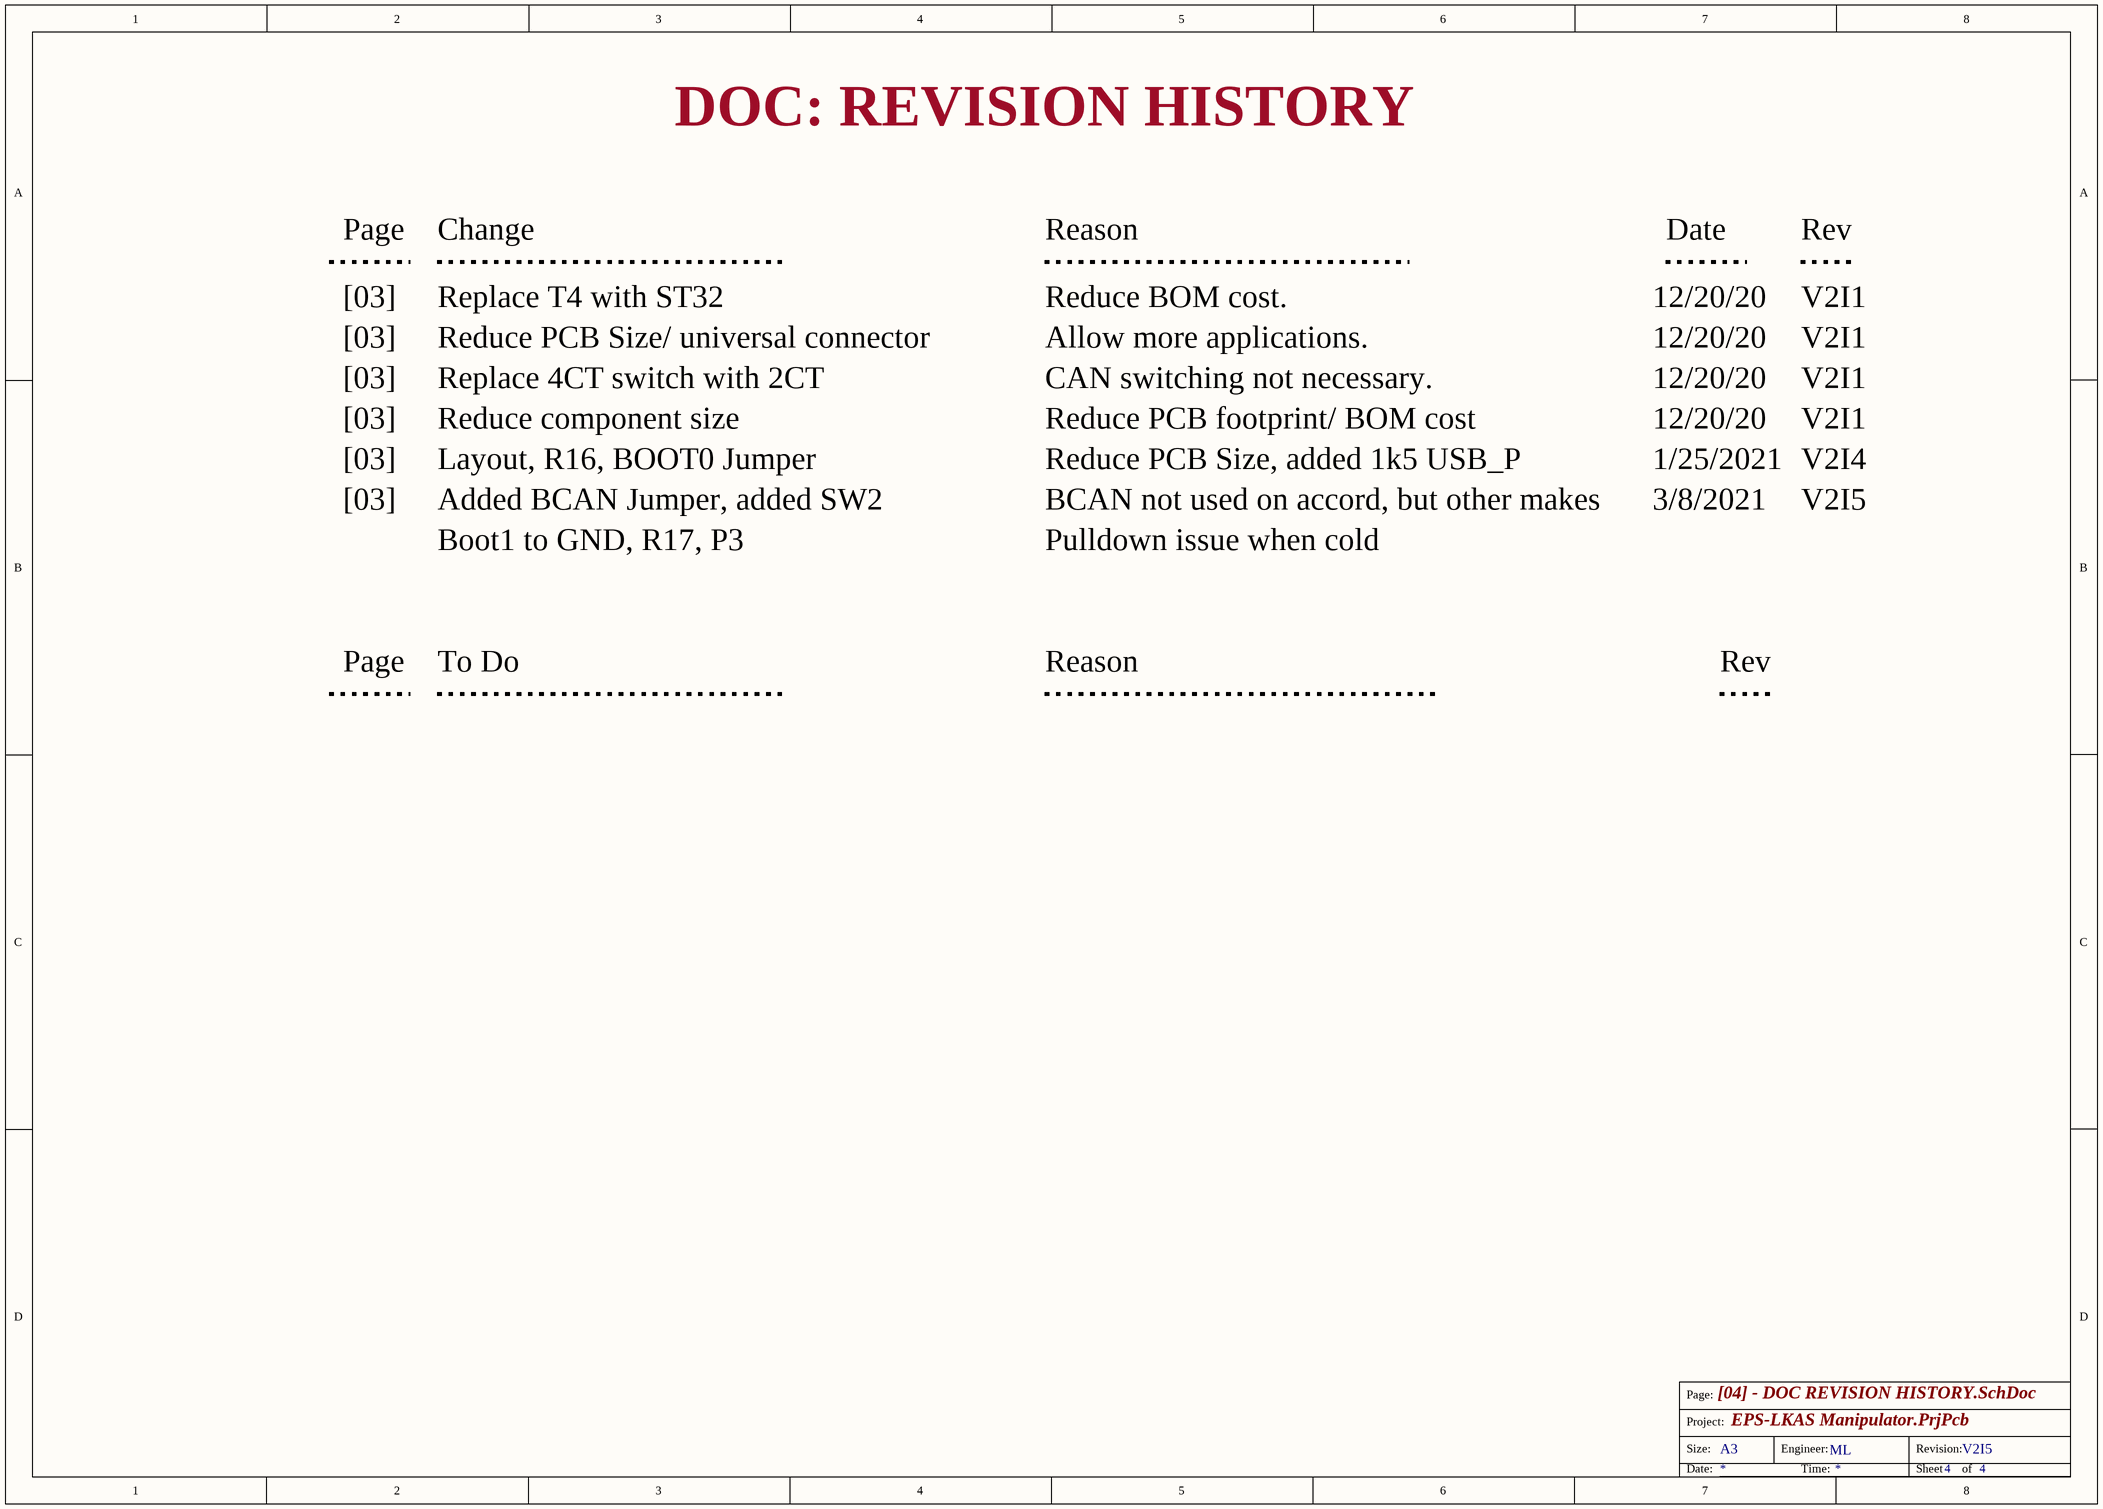
[diagram p1: [04] - DOC REVISION HISTORY.SchDoc]

### Notes on the sheet
- DOC: REVISION HISTORY
- Page
- Change
- Reason
- Date
- Rev
- [03]
- Replace T4 with ST32
- Reduce BOM cost.
- 12/20/20
- V2I1
- Reduce PCB Size/ universal connector
- Allow more applications.
- Replace 4CT switch with 2CT
- Reduce component size
- CAN switching not necessary.
- Reduce PCB footprint/ BOM cost
- Layout, R16, BOOT0 Jumper
- Added BCAN Jumper, added SW2
- Reduce PCB Size, added 1k5 USB_P
- BCAN not used on accord, but other makes
- 1/25/2021
- 3/8/2021
- V2I4
- V2I5
- Boot1 to GND, R17, P3
- Pulldown issue when cold
- To Do
- CLOCKS (CPU & PCIE)
- Page:
- Size:
- Project:
- A3
- Engineer:
- ML
- Revision:
- Date:
- Time:
- Sheet
- of